# Altium project LED_SEQUENCER.PrjPcb
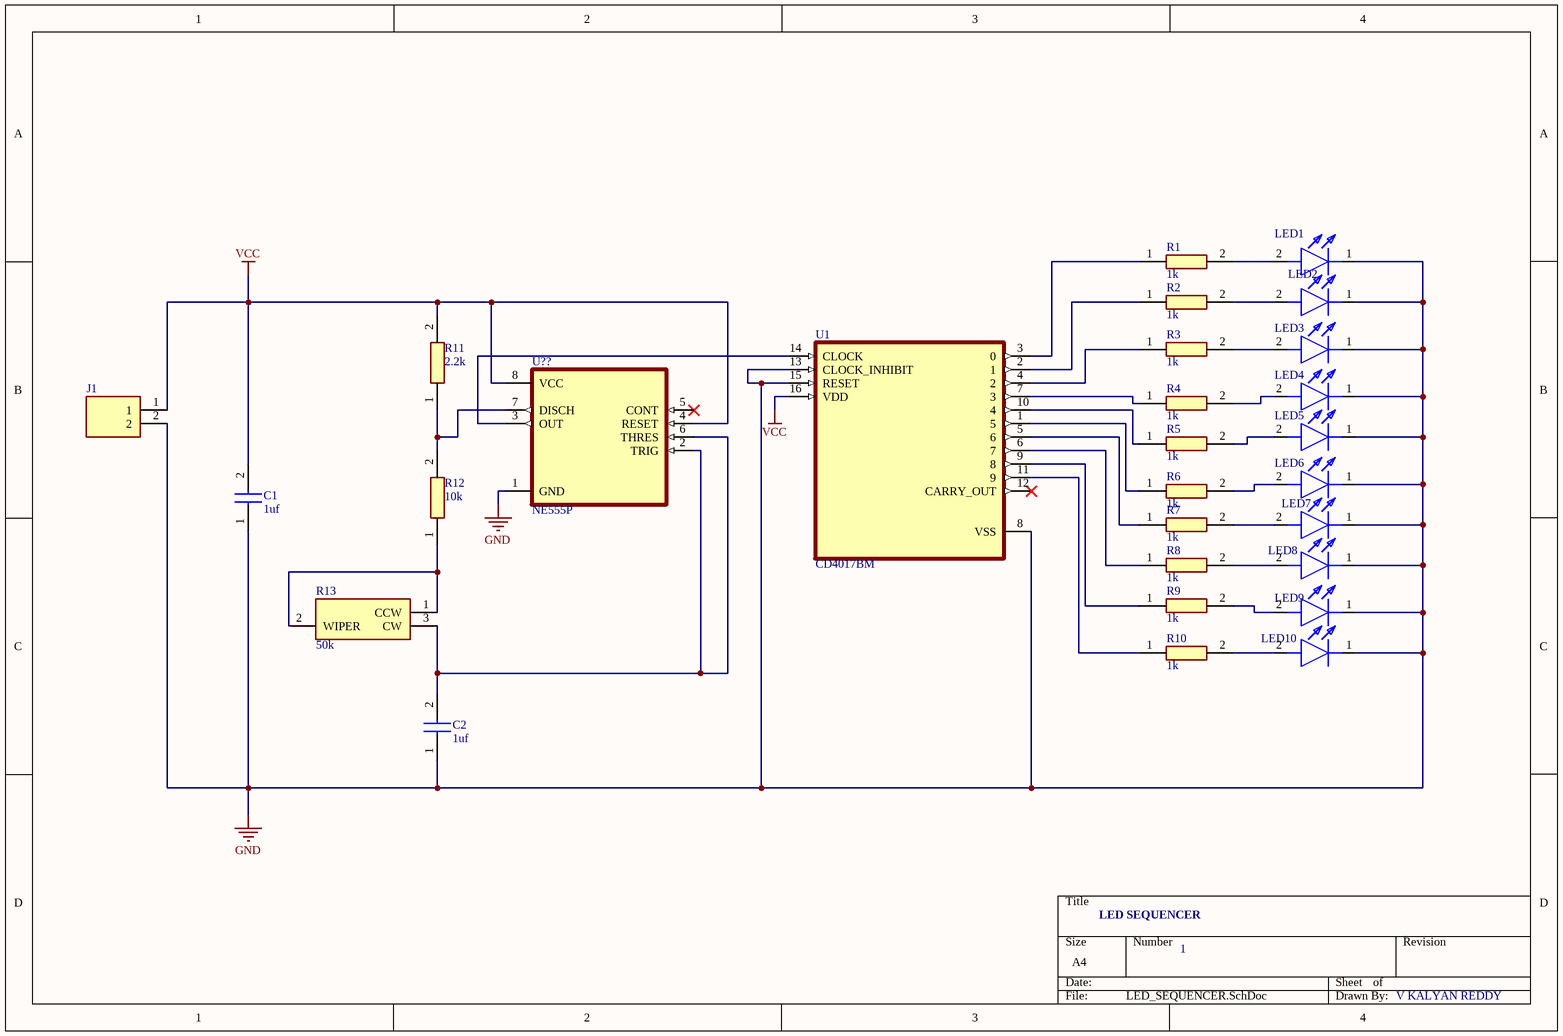
[diagram p0: LED_SEQUENCER.SchDoc]
1 sheet, 28 parts. Net scope: global (net labels, ports and power ports of the same name join across sheets).
Board file: LED_SEQUENCER.PcbDoc

## Sheet LED_SEQUENCER.SchDoc
size A4; SheetNumber: 1; SheetTotal: 1

### Parts
C1  1uf  [CAPC2012X145N]
C2  1uf  [CAPC2012X145N]
J1  M20-9990246  [HDRV2W66P0X254_1X2_508X254X874P]  (value not drawn)
LED1  HLMP-1301  [HLMP1301]  (value not drawn)
LED2  HLMP-1301  [HLMP1301]  (value not drawn)
LED3  HLMP-1301  [HLMP1301]  (value not drawn)
LED4  HLMP-1301  [HLMP1301]  (value not drawn)
LED5  HLMP-1301  [HLMP1301]  (value not drawn)
LED6  HLMP-1301  [HLMP1301]  (value not drawn)
LED7  HLMP-1301  [HLMP1301]  (value not drawn)
LED8  HLMP-1301  [HLMP1301]  (value not drawn)
LED9  HLMP-1301  [HLMP1301]  (value not drawn)
LED10  HLMP-1301  [HLMP1301]  (value not drawn)
R1  1k  [RESC2012X60N]
R2  1k  [RESC2012X60N]
R3  1k  [RESC2012X60N]
R4  1k  [RESC2012X60N]
R5  1k  [RESC2012X60N]
R6  1k  [RESC2012X60N]
R7  1k  [RESC2012X60N]
R8  1k  [RESC2012X60N]
R9  1k  [RESC2012X60N]
R10  1k  [RESC2012X60N]
R11  2.2k  [RESC2012X60N]
R12  10k  [RESC2012X60N]
R13  50k  [3386P_1]
U1  CD4017BM  [SOIC127P600X175-16N]
U2  NE555P  [DIP794W45P254L959H508Q8]

### Nets
GND: C1.1 C2.1 J1.2 LED1.1(K) LED2.1(K) LED3.1(K) LED4.1(K) LED5.1(K) LED6.1(K) LED7.1(K) LED8.1(K) LED9.1(K) LED10.1(K) U1.8(VSS) U1.13(CLOCK_INHIBIT) U1.15(RESET) U2.1(GND)
VCC: C1.2 J1.1 R11.2 U1.16(VDD) U2.4(RESET) U2.8(VCC)
NetC2_2: C2.2 R13.3(CW) U2.2(TRIG) U2.6(THRES)
NetLED1_2: LED1.2(A) R1.2
NetLED2_2: LED2.2(A) R2.2
NetLED3_2: LED3.2(A) R3.2
NetLED4_2: LED4.2(A) R4.2
NetLED5_2: LED5.2(A) R5.2
NetLED6_2: LED6.2(A) R6.2
NetLED7_2: LED7.2(A) R7.2
NetLED8_2: LED8.2(A) R8.2
NetLED9_2: LED9.2(A) R9.2
NetLED10_2: LED10.2(A) R10.2
NetR1_1: R1.1 U1.3(0)
NetR2_1: R2.1 U1.2(1)
NetR3_1: R3.1 U1.4(2)
NetR4_1: R4.1 U1.7(3)
NetR5_1: R5.1 U1.10(4)
NetR6_1: R6.1 U1.1(5)
NetR7_1: R7.1 U1.5(6)
NetR8_1: R8.1 U1.6(7)
NetR9_1: R9.1 U1.9(8)
NetR10_1: R10.1 U1.11(9)
NetR11_1: R11.1 R12.2 U2.7(DISCH)
NetR12_1: R12.1 R13.1(CCW) R13.2(WIPER)
NetU1_14: U1.14(CLOCK) U2.3(OUT)

Not connected (* = marked no-connect by the designer): U1 12(CARRY_OUT)*; U2 5(CONT)*

### Notes on the sheet
- LED SEQUENCER
- 1
- V KALYAN REDDY

### Library data of the parts
C1 C2 = GRM21BR71H105KA12L: Capacitor; Manufacturer_Name: Murata Electronics; Datasheet Link: http://www.murata.com/~/media/webrenewal/support/library/catalog/products/capacitor/mlcc/c02e.pdf; Height: 1.45mm; Manufacturer_Part_Number: GRM21BR71H105KA12L; Mouser Part Number: 81-GRM21BR71H105KA2L; Mouser Price/Stock: https://www.mouser.co.uk/ProductDetail/Murata-Electronics/GRM21BR71H105KA12L?qs=Er06SXQpt%252B60EIT%2FJ7%2F41Q%3D%3D; Arrow Part Number: GRM21BR71H105KA12L; Arrow Price/Stock: https://www.arrow.com/en/products/grm21br71h105ka12l/murata-manufacturing?region=europe
J1 = M20-9990246: Connector; Manufacturer_Name: Harwin; Datasheet Link: https://cdn.harwin.com/pdfs/M20-999.pdf; Height: 8.74mm; Manufacturer_Part_Number: M20-9990246; Mouser Part Number: 855-M20-9990246; Mouser Price/Stock: https://www.mouser.co.uk/ProductDetail/Harwin/M20-9990246?qs=Jph8NoUxIfWjw4WmyRvzag%3D%3D
LED1-LED10 = HLMP-1301: LED; Manufacturer_Name: Avago Technologies; Datasheet Link: https://componentsearchengine.com/Datasheets/2/HLMP-1301.pdf; Height: 6.35mm; Manufacturer_Part_Number: HLMP-1301; Mouser Part Number: 630-HLMP-1301; Mouser Price/Stock: https://www.mouser.co.uk/ProductDetail/Broadcom-Avago/HLMP-1301?qs=jT9z6tsiFNkJAuA0Y2YdzA%3D%3D; Arrow Part Number: HLMP-1301; Arrow Price/Stock: https://www.arrow.com/en/products/hlmp-1301/broadcom-limited
R1-R12 = RC0805FR-071KL: Resistor; Manufacturer_Name: KEMET; Datasheet Link: http://www.yageo.com/documents/recent/PYu-RC_Group_51_RoHS_L_10.pdf; Height: 0.6mm; Manufacturer_Part_Number: RC0805FR-071KL; Mouser Part Number: 603-RC0805FR-071KL; Mouser Price/Stock: https://www.mouser.co.uk/ProductDetail/YAGEO/RC0805FR-071KL?qs=1ogmaHw32WJjeGY0DHXakQ%3D%3D; Arrow Part Number: RC0805FR-071KL; Arrow Price/Stock: https://www.arrow.com/en/products/rc0805fr-071kl/yageo?region=nac
R13 = 3386P-1-104LF: Variable Resistor; Manufacturer_Name: Bourns; Datasheet Link: https://componentsearchengine.com/Datasheets/2/3386P-1-104LF.pdf; Manufacturer_Part_Number: 3386P-1-104LF; Mouser Part Number: 652-3386P-1-104LF; Mouser Price/Stock: https://www.mouser.co.uk/ProductDetail/Bourns/3386P-1-104LF?qs=m2uG%2FFdTAPVt57WUqvIChw%3D%3D; Arrow Part Number: 3386P-1-104LF; Arrow Price/Stock: https://www.arrow.com/en/products/3386p-1-104lf/bourns?region=nac
U1 = CD4017BM: CMOS Decade Counter with 10 Decoded Outputs; MF: Texas Instruments; Check_prices: https://www.snapeda.com/parts/CD4017BM/Texas+Instruments/view-part/?ref=eda; Value: *; Availability: In Stock; MP: CD4017BM; Price: None; Package: SOIC-16 Texas Instruments; SnapEDA_Link: https://www.snapeda.com/parts/CD4017BM/Texas+Instruments/view-part/?ref=snap; Purchase-URL: https://pricing.snapeda.com/search/part/CD4017BM/?ref=eda
U?? = NE555P: Package: None; Price: None; Value: *; MP: NE555P; Availability: Unavailable